# EAGLE design LPC_2TE_3.3 (EAGLE 5.00)
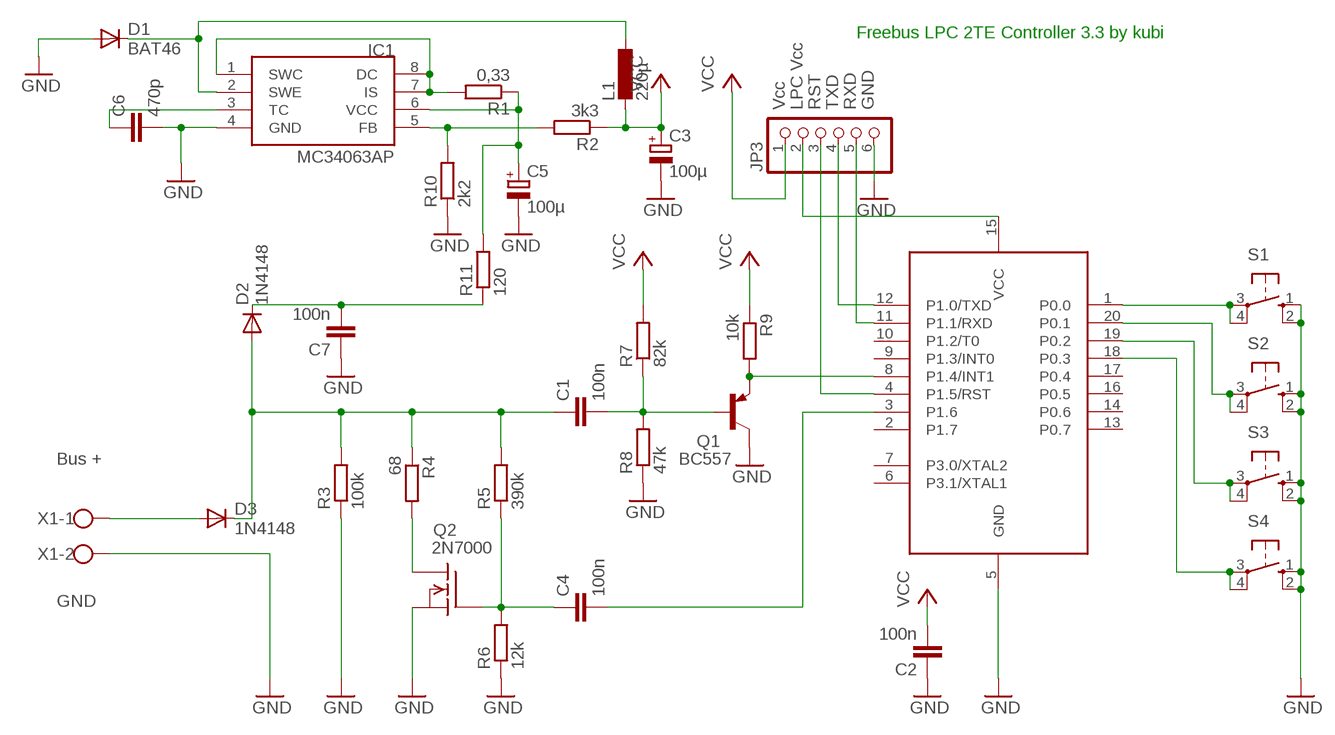
[diagram p0: schematic, sheet 1]

## Parts
C1  100n  C-EU050-024X044  [C050-024X044]
C2  100n  C-EU050-024X044  [C050-024X044]
C3  100µ  CPOL-EUE3.5-8  [E3,5-8]
C4  100n  C-EU050-024X044  [C050-024X044]
C5  100µ  CPOL-EUE3.5-8  [E3,5-8]
C6  470p  C-EU025-024X044  [C025-024X044]
C7  100n  C-EU050-024X044  [C050-024X044]
D1  BAT46  BAT81  [DO34-7]
D2  1N4148  [DO35-10]
D3  1N4148  [DO35-10]
IC1  MC34063AP  [DIL08]
JP3  PINHD-1X6  [1X06]
L1  220µ  L-EU0207/2V  [0207/2V]
Q1  BC557  [TO92]
Q2  2N7000  VN2222KM  [TO237]
R1  0,33  R-EU_0207/2V  [0207/2V@1]
R2  3k3  R-EU_0207/2V  [0207/2V@1]
R3  100k  R-EU_0207/2V  [0207/2V@1]
R4  68  R-EU_0207/2V  [0207/2V@1]
R5  390k  R-EU_0207/2V  [0207/2V@1]
R6  12k  R-EU_0207/2V  [0207/2V@1]
R7  82k  R-EU_0207/2V  [0207/2V@1]
R8  47k  R-EU_0207/10  [0207/10@1]
R9  10k  R-EU_0207/10  [0207/10@1]
R10  2k2  R-EU_0207/2V  [0207/2V@1]
R11  120  R-EU_0207/2V  [0207/2V@1]
S1  10-XX  [B3F-10XX]
S2  10-XX  [B3F-10XX]
S3  10-XX  [B3F-10XX]
S4  10-XX  [B3F-10XX]
U1  89LPC922  [DIL20]
X1  W237-102  [W237-102]

## Nets
GND: C2.1 C3.- C5.- C6.2 C7.1 D1.A IC1.4(GND) JP3.6 Q1.3(C) Q2.3(S) R3.1 R6.1 R8.1 R10.1 S1.1(S) S1.2(S1) S2.1(S) S2.2(S1) S3.1(S) S3.2(S1) S4.1(S) S4.2(S1) U1.5(GND) X1.2
N$1: Q1.1(E) R9.2 U1.8(P1.4/INT1)
N$2: C1.2 Q1.2(B) R7.1 R8.2
N$4: C1.1 D2.A D3.C R3.2 R4.1 R5.2
N$5: C4.2 U1.3(P1.6)
N$6: Q2.1(D) R4.2
N$8: IC1.1(SWC) IC1.7(IS) IC1.8(DC) R1.2
N$10: C5.+ IC1.6(VCC) R1.1 R11.2
N$11: IC1.5(FB) R2.2 R10.2
N$12: D1.C IC1.2(SWE) L1.1
N$13: C7.2 D2.C R11.1
N$14: C6.1 IC1.3(TC)
N$15: D3.A X1.1
N$29: JP3.4 U1.12(P1.0/TXD)
N$30: JP3.5 U1.11(P1.1/RXD)
N$31: JP3.3 U1.4(P1.5/RST)
N$32: JP3.2 U1.15(VCC)
N$34: C4.1 Q2.2(G) R5.1 R6.2
P0.0: S1.3(P) S1.4(P1) U1.1(P0.0)
P0.1: S2.3(P) S2.4(P1) U1.20(P0.1)
P0.2: S3.3(P) S3.4(P1) U1.19(P0.2)
P0.3: S4.3(P) S4.4(P1) U1.18(P0.3)
VCC: C2.2 C3.+ JP3.1 L1.2 R2.1 R7.2 R9.1
Unconnected: U1.2(P1.7) U1.6(P3.1/XTAL1) U1.7(P3.0/XTAL2) U1.9(P1.3/INT0) U1.10(P1.2/T0) U1.13(P0.7) U1.14(P0.6) U1.16(P0.5) U1.17(P0.4)

## Notes on the sheet
- Freebus LPC 2TE Controller 3.3 by kubi
- Vcc | LPC Vcc | RST | TXD | RXD | GND
- Bus +
- GND

## Library data of the parts
C1 C2 C4 C6 C7 = rcl:C-EU: CAPACITOR, European symbol
C3 C5 = rcl:CPOL-EU: POLARIZED CAPACITOR, European symbol
D1 = diode:BAT81: DIODE barrier diode
D2 D3 = diode:1N4148: DIODE high speed (Philips)
IC1 = mc34063:MC34063
JP3 = pinhead:PINHD-1X6: PIN HEADER
L1 = rcl:L-EU: INDUCTOR, European symbol
Q1 = transistor-pnp:BC557: PNP Transistor
Q2 = transistor-fet:VN2222KM: N-Channel Enhancement MOSFET (VMOS); 60V; 0,5A; 7,5Ohm
R1-R11 = rcl:R-EU_: RESISTOR, European symbol
S1-S4 = switch-omron:10-XX: OMRON SWITCH
U1 = micro-philips:89LPC922
X1 = con-wago-500:W237-102: WAGO SCREW CLAMP

## Board
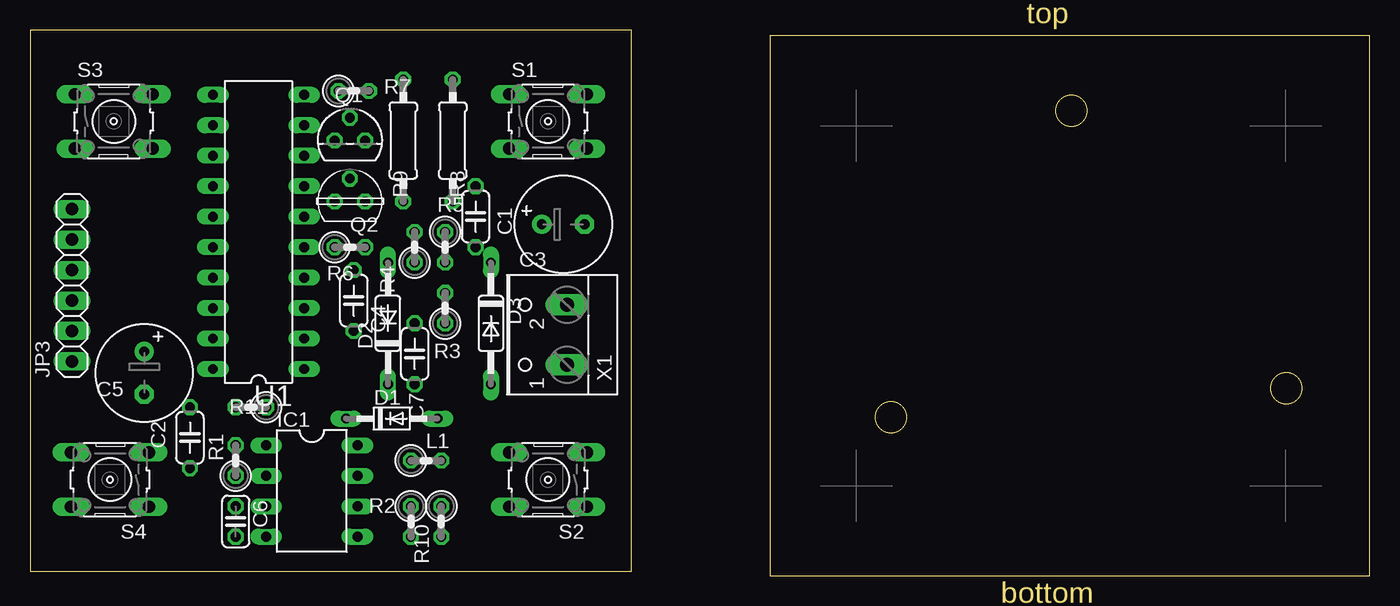
[diagram p1: board, top side]
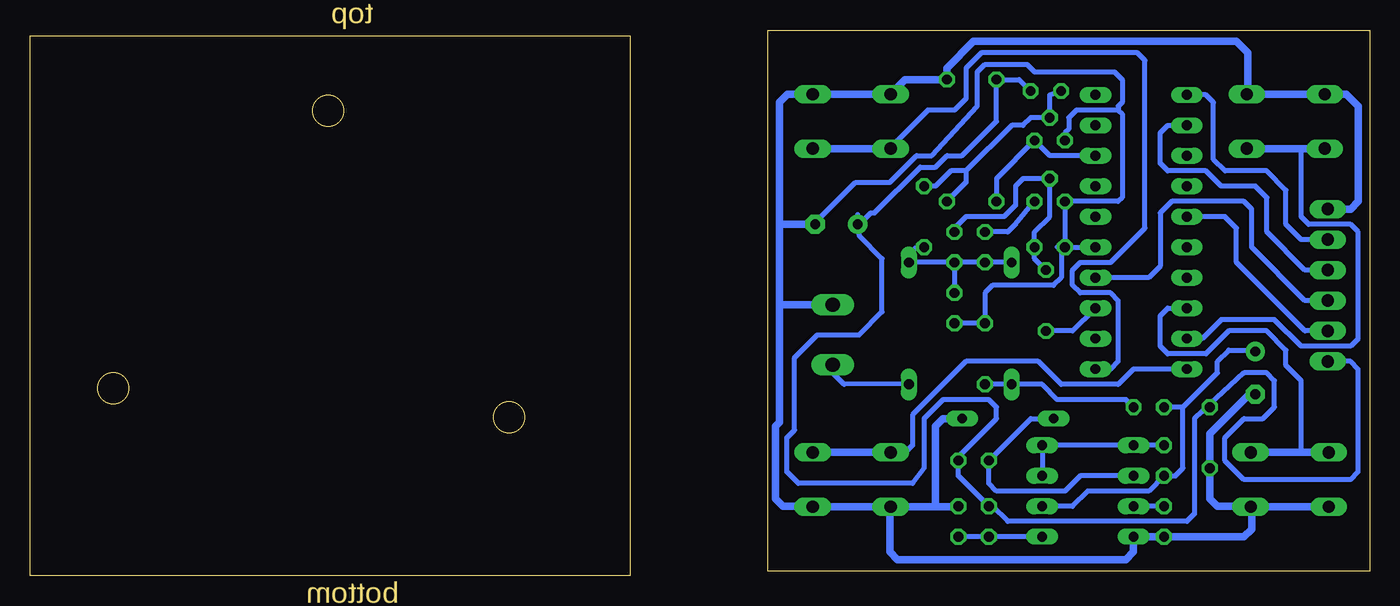
[diagram p2: board, bottom side, seen from below]

Size 111.68 x 45.47 mm. Coordinates in mm from the lower left corner, seen from the top.
Outline: 0,0.39 50.16,0.39 50.16,45.47 0,45.47 0,0.39
Outline: 61.68,0 111.68,0 111.68,45 61.68,45 61.68,0
Outline: circle at 71.75,13.21 radius 1.3
Outline: circle at 86.81,38.73 radius 1.3
Outline: circle at 104.73,15.6 radius 1.3
Copper layers (1*16): Top 0.035mm / dielectric 1.5mm / Bottom 0.035mm
Design rules "default *": minimum track width 10mil, minimum drill 24mil, track to track 12mil, track to pad 12mil, pad to pad 12mil, via to via 16mil, smd to smd 8mil, copper to edge 20mil, drill to drill 8mil, minimum pad ring 10mil, minimum via ring 8mil, stop-mask expansion 4mil, vias tented up to drill 0mil, thermal gap 10mil
tKeepout: area 35.6,0.4 to 50.2,15; area 35.6,30.9 to 50.2,45.5; area 0,30.9 to 14.6,45.5; area 0,0.4 to 14.6,15; area 92.1,18 to 93.4,21.2; area 79.9,17.9 to 81.2,27.9; area 61.7,17.2 to 66.7,27.2; area 76.2,17.2 to 81.2,27.2; area 92.1,17.2 to 97.1,27.2; area 106.7,17.2 to 111.7,27.2; area 61.7,0 to 111.7,2.8; area 61.7,42.2 to 111.7,45; 5 more areas
bKeepout: area 77.9,44 to 95.5,45; area 107.7,0.1 to 111.7,45; area 61.7,0 to 111.6,1; area 61.7,0.1 to 65.8,45; area 65.8,38.3 to 72,44.9; area 72.1,41.7 to 75.5,45; area 75.5,43.2 to 77.2,45; area 65.9,34.9 to 68.7,38.3; area 65.8,33.4 to 67.1,34.9; area 68.7,36.6 to 70.3,38.2; area 72.1,39.9 to 73.8,41.7; area 65.7,0.8 to 70.8,7.7; 25 more areas; 10 lines

### Footprints (pad centres in the part's own frame; a part is rotated, then mirrored left to right if it is on the bottom)
C050-024X044 = drill 0.813 octagon: 1 -2.54,0; 2 2.54,0
E3,5-8 = drill 0.813 pad 1.6 round: + -1.778,0 | drill 0.813 pad 1.6 octagon: - 1.778,0
C025-024X044 = drill 0.813 octagon: 1 -1.27,0; 2 1.27,0
DO34-7 = drill 0.813 long: A 3.81,0; C -3.81,0
DO35-10 = drill 0.813 long: A 5.08,0; C -5.08,0
DIL08 = drill 0.813 long: 1 -3.81,-3.81; 2 -1.27,-3.81; 3 1.27,-3.81; 4 3.81,-3.81; 5 3.81,3.81; 6 1.27,3.81; 7 -1.27,3.81; 8 -3.81,3.81
1X06 = drill 1.016 long: 1 -6.35,0; 2 -3.81,0; 3 -1.27,0; 4 1.27,0; 5 3.81,0; 6 6.35,0
0207/2V = drill 0.813 octagon: 1 -1.27,0; 2 1.27,0
TO92 = drill 0.813 octagon: 1 1.27,0; 2 0,1.905; 3 -1.27,0
TO237 = drill 0.813 octagon: 1 1.27,0; 2 0,1.905; 3 -1.27,0
0207/2V@1 = drill 0.813 octagon: 1 -1.27,0; 2 1.27,0
0207/10@1 = drill 0.813 octagon: 1 -5.08,0; 2 5.08,0
B3F-10XX = drill 1.016 long: 1 -3.251,2.261; 2 3.251,2.261; 3 -3.251,-2.261; 4 3.251,-2.261
DIL20 = drill 0.813 long: 1 -11.43,-3.81; 2 -8.89,-3.81; 3 -6.35,-3.81; 4 -3.81,-3.81; 5 -1.27,-3.81; 6 1.27,-3.81; 7 3.81,-3.81; 8 6.35,-3.81; 9 8.89,-3.81; 10 11.43,-3.81; 11 11.43,3.81; 12 8.89,3.81; 13 6.35,3.81; 14 3.81,3.81; 15 1.27,3.81; 16 -1.27,3.81; 17 -3.81,3.81; 18 -6.35,3.81; 19 -8.89,3.81; 20 -11.43,3.81
W237-102 = drill 1.194 long: 1 -2.5,-1.27; 2 2.5,-1.27

### Placement (x,y rotation side)
C1  37.15,29.91 90 top
C2  13.34,11.5 90 top
C3  44.45,29.28 0 top
C4  26.99,22.93 270 top
C5  9.53,16.9 270 top
C6  17.14,4.51 270 top
C7  32.07,18.48 270 top
D1  30.16,13.08 0 top
D2  29.84,21.02 90 top
D3  38.42,21.02 270 top
IC1  23.5,7.05 270 top
JP3  3.49,24.2 90 top
L1  33.02,9.59 0 top
Q1  26.67,36.26 0 top
Q2  26.67,31.18 0 top
R1  17.14,9.59 90 top
R2  31.75,4.51 270 top
R3  34.61,22.29 90 top
R4  32.07,27.37 90 top
R5  34.61,27.37 270 top
R6  26.67,27.37 0 top
R7  26.99,40.39 0 top
R8  35.24,36.26 270 top
R9  31.11,36.26 270 top
R10  34.29,4.51 270 top
R11  18.41,14.04 180 top
S1  43.18,37.85 0 top
S2  43.18,8.01 180 top
S3  6.99,37.85 0 top
S4  6.67,8.01 180 top
U1  19.05,28.64 90 top
X1  43.5,20.07 90 top

### Tracks (layer width: path | path; a pad name or v marks a point on that pad's centre or on a via)
GND
  Bottom 0.406: R6.1 26.04,27.37 | 20.95,38.8 20.64,38.48 20.64,31.5 20.95,31.18 Q2.3 R6.1 | R6.1 U1.5 | R6.1 25.72,27.06 25.72,24.83 26.35,24.2 31.43,24.2 32.07,23.56 C7.1 R3.1 | Q1.3 25.4,36.9 25.08,37.21 25.08,38.17 24.45,38.8 20.95,38.8 | 20.95,38.8 20.95,39.12 20.64,39.44 20.64,41.34 21.27,41.98 27.94,41.98 28.57,42.61 32.07,42.61 32.7,41.98 32.7,39.12 36.51,34.99 37.78,34.99 40.01,32.77 42.86,32.77 46.35,29.28
  Bottom 0.61: 49.21,22.61 49.21,29.28 | 49.21,29.28 49.21,39.44 48.54,40.11 S1.2 40.04,40.11 40.01,40.07 | 40.01,5.78 40.04,5.74 S2.1 46.39,5.74 46.35,5.78 48.9,5.78 49.53,6.42 49.53,12.45 49.21,12.77 49.21,22.61 | 36.2,5.74 S2.2 39.97,5.74 40.01,5.78 | 36.2,5.74 34.33,5.74 R10.1 | 40.01,5.78 40.01,1.97 39.37,1.34 20.32,1.34 19.68,1.97 IC1.4 C6.2 10.48,3.24 9.84,3.88 9.84,5.78 | S4.2 3.45,5.74 3.49,5.78 3.53,5.74 S4.1 9.88,5.74 9.84,5.78 | D1.A 35.56,13.08 36.2,12.45 36.2,5.74 | 40.01,40.07 39.97,40.11 S1.1 | 40.01,40.07 38.73,41.34 R8.1 35.24,42.29 33.02,44.52 11.11,44.52 10.16,43.56 10.16,40.07 | 10.16,40.07 10.12,40.11 S3.1 1.94,40.11 0.95,39.12 0.95,31.18 1.59,30.55 JP3.6 | 10.16,40.07 10.2,40.11 S3.2 | 49.21,29.28 46.35,29.28 C3.- | C5.- 10.16,14.99 13.34,11.81 C2.1 13.34,6.42 12.7,5.78 9.84,5.78 | X1.2 48.85,22.57 49.21,22.61
N$1
  Bottom 0.406: U1.8 26.67,34.99 Q1.1 31.11,33.09 R9.2
N$2
  Bottom 0.406: R7.1 26.67,40.07 Q1.2 28.26,38.17 28.89,37.53 29.84,37.53 33.66,33.72 | 33.66,33.72 34.92,33.72 36.2,32.45 C1.2 | 33.66,33.72 33.66,32.77 R8.2
N$4
  Bottom 0.406: R5.2 R3.2 | D2.A R4.1 R5.2 | R5.2 D3.C 38.42,26.74 37.78,27.37 C1.1
N$5
  Bottom 0.406: C4.2 24.77,20.39 U1.3
N$6
  Bottom 0.406: Q2.1 29.53,29.28 30.16,28.64 R4.2
N$8
  Bottom 0.406: IC1.7 IC1.8 IC1.1 R1.2
N$10
  Bottom 0.406: IC1.6 24.77,5.78 23.5,7.05 18.41,7.05 R1.1 16.19,8.32 15.56,8.96 15.56,14.04 | C5.+ 9.53,18.8 11.75,18.8 12.7,17.85 12.7,16.9 15.56,14.04 | 15.56,14.04 R11.2
N$11
  Bottom 0.406: IC1.5 R2.2 R10.2
N$12
  Bottom 0.406: IC1.2 24.13,8.32 25.4,7.05 31.11,7.05 31.75,7.69 L1.1 28.26,13.08 D1.C
N$13
  Bottom 0.406: R11.1 20.32,14.67 26.04,14.67 27.3,15.94 D2.C C7.2
N$14
  Bottom 0.406: C6.1 IC1.3
N$15
  Bottom 0.406: X1.1 44.77,16.9 43.81,15.94 38.14,15.98 D3.A
N$29
  Bottom 0.406: U1.12 16.83,37.53 17.46,36.9 17.46,34.36 16.83,33.72 13.65,33.72 12.38,32.45 9.53,32.45 8.57,31.5 8.57,28.64 5.4,25.47 JP3.4
N$30
  Bottom 0.406: U1.11 13.65,40.07 13.02,39.44 13.02,34.67 12.06,33.72 8.57,33.72 6.99,32.13 6.99,29.28 5.71,28.01 3.81,28.01 3.49,28.33 JP3.5
N$31
  Bottom 0.406: JP3.3 5.4,22.93 9.84,27.37 9.84,30.55 10.48,31.18 16.51,31.18 17.46,30.23 17.46,25.79 18.41,24.83 U1.4
N$32
  Bottom 0.406: U1.15 12.06,29.91 11.11,28.96 11.11,26.1 5.4,20.39 JP3.2
N$34
  Bottom 0.406: C4.1 27.94,26.42 R6.2 27.94,28.64 26.67,29.91 Q2.2 28.89,33.09 29.53,32.45 29.53,30.87 30.48,29.91 33.66,29.91 34.61,28.96 R5.1
P0.0
  Bottom 0.406: S1.3 39.93,35.7 36.83,38.8 34.61,38.8 33.66,39.75 33.66,42.29 32.38,43.56 19.37,43.56 18.73,42.93 18.73,28.96 21.59,26.1 24.13,26.1 24.77,25.47 24.77,24.2 24.13,23.56 21.59,23.56 20.95,22.93 20.95,17.85 21.59,17.21 U1.1
  Bottom 0.61: S1.3 39.97,35.59 40.01,35.63 40.04,35.59 S1.4
P0.1
  Bottom 0.406: U1.20 19.68,17.21 20.95,15.94 25.72,15.94 27.62,17.85 33.66,17.85 38.1,13.4 38.1,10.86 38.73,10.23 40.01,10.23
  Bottom 0.61: S2.4 39.97,10.27 40.01,10.23 40.04,10.27 S2.3
P0.2
  Bottom 0.406: U1.19 13.97,19.75 12.38,21.34 7.94,21.34 5.71,19.12 1.59,19.12 0.95,19.75 0.95,28.64 1.59,29.28 5.08,29.28 5.71,29.91 5.71,35.59 5.4,35.63
  Bottom 0.61: S3.3 3.77,35.59 3.81,35.63 3.85,35.59 5.71,35.59 S3.4
P0.3
  Bottom 0.406: U1.18 16.83,22.29 17.46,21.66 17.46,19.12 16.83,18.48 13.65,18.48 11.75,20.39 8.57,20.39 6.99,18.8 6.99,17.53 5.71,16.26 5.71,10.54 6.03,10.23 6.03,10.27 | 9.84,10.23 9.88,10.27 S4.3
  Bottom 0.61: S4.4 3.45,10.27 3.49,10.23 3.53,10.27 6.03,10.27 S4.3
VCC
  Bottom 0.406: JP3.1 1.59,17.85 0.95,17.21 0.95,8.64 1.59,8.01 10.48,8.01 12.06,9.59 12.06,11.5 10.48,13.08 8.89,13.08 7.94,14.04 7.94,16.26 8.57,16.9 10.48,16.9 13.95,13.69 | 42.55,29.28 C3.+ 42.55,28.33 40.64,26.42 40.64,21.98 42.55,20.07 46.04,20.07 47.94,18.17 47.94,12.13 48.58,11.5 48.58,8.64 47.62,7.69 38.1,7.69 37.15,8.96 37.15,13.08 35.56,14.67 31.75,14.67 31.11,14.04 31.11,13.08 34.29,9.91 L1.2 34.29,8.32 R2.1 31.43,5.78 30.16,4.51 15.24,4.51 14.61,5.15 14.61,13.08 13.95,13.69 | 42.55,29.28 42.67,30.1 | 42.55,29.28 41.59,30.23 41.27,30.23 37.47,34.04 36.2,34.04 35.24,34.99 33.97,34.99 31.11,37.85 R9.1 29.21,41.34 R7.2 | 13.95,13.69 13.95,13.7 13.97,13.72 13.65,14.04 C2.2

### Text on the board
Dimension: top | bottom
tDocu: tiefe hinten 2.84 | tiefe vorne 2.8 | Platine 1.00mm